# Altium schematic sheet audio_pa6.SchDoc: mcHF QRP Transceiver UI board
size A4; Author: K Atanassov; CompanyName: M0NKA; Revision: 0.6.3; SheetTotal: 5
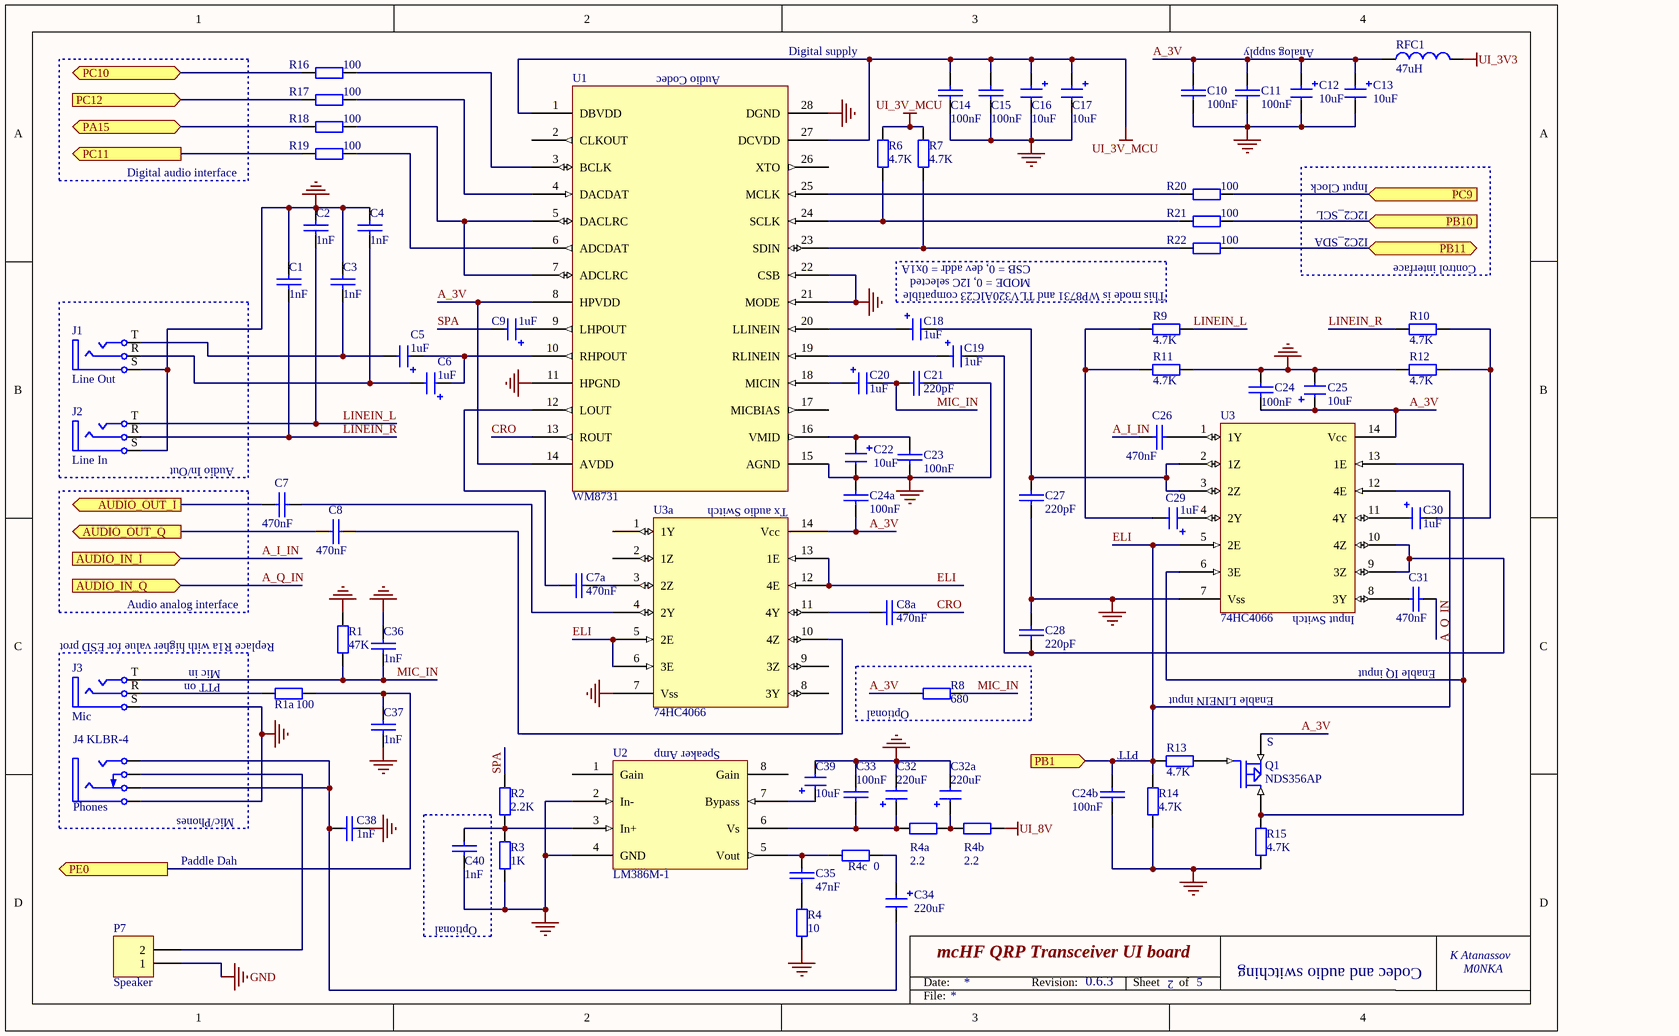
[diagram p0: audio_pa6.SchDoc]

## Parts
C1  1nF  [0805-Pro]
C2  1nF  [0805-Pro]
C3  1nF  [0805-Pro]
C4  1nF  [0805-Pro]
C5  1uF  [1206_ELEC_CAP_N]
C6  1uF  [1206_ELEC_CAP_N]
C7  470nF  [0805-Pro]
C7a  470nF  [0805-Pro]
C8  470nF  [0805-Pro]
C8a  470nF  [0805-Pro]
C9  1uF  [1206_ELEC_CAP_N]
C10  100nF  [0805-Pro]
C11  100nF  [0805-Pro]
C12  10uF  [1206_ELEC_CAP_N]
C13  10uF  [1206_ELEC_CAP_N]
C14  100nF  [0805-Pro]
C15  100nF  [0805-Pro]
C16  10uF  [1206_ELEC_CAP_N]
C17  10uF  [1206_ELEC_CAP_N]
C18  1uF  [1206_ELEC_CAP_N]
C19  1uF  [1206_ELEC_CAP_N]
C20  1uF  [1206_ELEC_CAP_N]
C21  220pF  [0805-Pro]
C22  10uF  [1206_ELEC_CAP_N]
C23  100nF  [0805-Pro]
C24  100nF  [0805-Pro]
C24a  100nF  [0805-Pro]
C24b  100nF  [0805-Pro]
C25  10uF  [1206_ELEC_CAP_N]
C26  470nF  [0805-Pro]
C27  220pF  [0805-Pro]
C28  220pF  [0805-Pro]
C29  1uF  [1206_ELEC_CAP_N]
C30  1uF  [1206_ELEC_CAP_N]
C31  470nF  [0805-Pro]
C32  220uF  [CAP_ALUM]
C32a  220uF  [CAP_ALUM]
C33  100nF  [0805-Pro]
C34  220uF  [CAP_ALUM]
C35  47nF  [0805-Pro]
C36  1nF  [0805-Pro]
C37  1nF  [0805-Pro]
C38  1nF  [0805-Pro]
C39  10uF  [1206_ELEC_CAP_N]
C40  1nF  [0805-Pro]
J1  Line Out  [MX-387GL_new1]
J2  Line In  [MX-387GL_new1]
J3  Mic  [MX-387GL_new1]
J4  KLBR-4  Function: Phones  [KLBR4]
P7  Speaker  [SIP2]
Q1  NDS356AP  [SOT-23-Pro]
R1  47K  [0805-Pro]
R1a  100  [0805-Pro]
R2  2.2K  [0805-Pro]
R3  1K  [0805-Pro]
R4  10  [0805-Pro]
R4a  2.2  [1206]
R4b  2.2  [1206]
R4c  0  [0805-Pro]
R6  4.7K  [0805-Pro]
R7  4.7K  [0805-Pro]
R8  680  [0805-Pro]  (no BOM)
R9  4.7K  [0805-Pro]
R10  4.7K  [0805-Pro]
R11  4.7K  [0805-Pro]
R12  4.7K  [0805-Pro]
R13  4.7K  [0805-Pro]
R14  4.7K  [0805-Pro]
R15  4.7K  [0805-Pro]
R16  100  [0805-Pro]
R17  100  [0805-Pro]
R18  100  [0805-Pro]
R19  100  [0805-Pro]
R20  100  [0805-Pro]
R21  100  [0805-Pro]
R22  100  [0805-Pro]
RFC1  47uH  [0805-Pro]
U1  WM8731  [SSOP-28-Pro]
U2  LM386M-1  [SO-8-Pro]
U3  74HC4066  [SO-14-Pro]
U3a  74HC4066  [SO-14-Pro]

## Blocks framed on the sheet
Audio In/Out: J1 J2
Optional: R8
Optional: C40

## Ports
AUDIO_IN_I (in), AUDIO_IN_Q (in), AUDIO_OUT_I (out), AUDIO_OUT_Q (out), PA15 (bidir), PB1 (in), PB10 (in), PB11 (bidir), PC9 (in), PC10 (bidir), PC11 (out), PC12 (in), PE0 (out)

## Nets
GND: C1.1 C2.1 C3.1 C4.1 C10.1 C11.1 C12.2 C13.2 C14.1 C15.1 C16.2 C17.2 C21.1 C22.2 C23.1 C24.2 C24a.1 C24b.1 C25.2 C27.2 C28.1 C32.2 C32a.2 C33.2 C36.1 C37.2 C38.2 C39.2 C40.1 J1.S J2.S J3.S J4.S P7.1 R1.2 R3.1 R4.1 R11.1 R12.2 R14.2 R15.2 U1.11(HPGND) U1.15(AGND) U1.21(MODE) U1.22(CSB) U1.28(DGND) U2.2(In-) U2.4(GND) U3.7(Vss) U3a.7(Vss)
UI_3V3: RFC1.2
UI_3V_MCU: C14.2 C15.2 C16.1 C17.1 R6.1 R7.1 U1.1(DBVDD) U1.27(DCVDD)
UI_8V: R4b.1
A_3V: C10.2 C11.2 C12.1 C13.1 C24.1 C24a.2 C25.1 Q1.2(S) R8.1 RFC1.1 U1.8(HPVDD) U1.14(AVDD) U3.14(Vcc) U3a.14(Vcc)
A_I_IN: C26.1 ; port AUDIO_IN_I
A_Q_IN: C31.2 ; port AUDIO_IN_Q
AUDIO_OUT_I: C7.1 ; port AUDIO_OUT_I
AUDIO_OUT_Q: C8.1 ; port AUDIO_OUT_Q
CRO: C8a.2 U1.13(ROUT)
ELI: C24b.2 R13.2 R14.1 U3.5(2E) U3.12(4E) U3a.5(2E) U3a.6(3E) U3a.12(4E) U3a.13(1E) ; port PB1
LINEIN_L: C2.2 J2.T R9.1
LINEIN_R: C1.2 J2.R R10.2
MIC_IN: C20.2 C21.2 C36.2 J3.T R1.1 R8.2
PA15: R18.1 ; port PA15
PB10: R21.2 ; port PB10
PB11: R22.2 ; port PB11
PC9: R20.2 ; port PC9
PC10: R16.1 ; port PC10
PC11: R19.1 ; port PC11
PC12: R17.1 ; port PC12
PE0: C37.1 R1a.2 ; port PE0
SPA: C9.2 R2.2
NetC3_2: C3.2 C5.2 J1.T
NetC4_2: C4.2 C6.2 J1.R
NetC5_1: C5.1 C6.1 U1.10(RHPOUT)
NetC7_2: C7.2 U3a.4(2Y)
NetC7a_1: C7a.1 U1.12(LOUT)
NetC7a_2: C7a.2 U3a.3(2Z)
NetC8_2: C8.2 U3a.10(4Z)
NetC8a_1: C8a.1 U3a.11(4Y)
NetC9_1: C9.1 U1.9(LHPOUT)
NetC18_1: C18.1 U1.20(LLINEIN)
NetC18_2: C18.2 C27.1 U3.2(1Z) U3.3(2Z)
NetC19_1: C19.1 U1.19(RLINEIN)
NetC19_2: C19.2 C28.2 U3.9(3Z) U3.10(4Z)
NetC20_1: C20.1 U1.18(MICIN)
NetC22_1: C22.1 C23.2 U1.16(VMID)
NetC26_2: C26.2 U3.1(1Y)
NetC29_1: C29.1 U3.4(2Y)
NetC29_2: C29.2 R9.2 R11.2
NetC30_1: C30.1 U3.11(4Y)
NetC30_2: C30.2 R10.1 R12.1
NetC31_1: C31.1 U3.8(3Y)
NetC32_1: C32.1 C33.1 R4a.2 U2.6(Vs)
NetC32a_1: C32a.1 R4a.1 R4b.2
NetC34_1: C34.1 R4c.2
NetC34_2: C34.2 C38.1 J4.R J4.T
NetC35_1: C35.1 R4.2
NetC35_2: C35.2 R4c.1 U2.5(Vout)
NetC39_1: C39.1 U2.7(Bypass)
NetC40_2: C40.2 R2.1 R3.2 U2.3(In+)
NetJ3_R: J3.R R1a.1
NetJ4_B: J4.B P7.2
NetQ1_1: Q1.1(G) R13.1
NetQ1_3: Q1.3(D) R15.1 U3.6(3E) U3.13(1E)
NetR6_2: R6.2 R21.1 U1.24(SCLK)
NetR7_2: R7.2 R22.1 U1.23(SDIN)
NetR16_2: R16.2 U1.3(BCLK)
NetR17_2: R17.2 U1.4(DACDAT)
NetR18_2: R18.2 U1.5(DACLRC) U1.7(ADCLRC)
NetR19_2: R19.2 U1.6(ADCDAT)
NetR20_1: R20.1 U1.25(MCLK)

Not connected (* = marked no-connect by the designer): U1 2(CLKOUT) 17(MICBIAS) 26(XTO); U2 1(Gain) 8(Gain); U3a 1(1Y) 2(1Z) 8(3Y) 9(3Z)

## Notes on the sheet
- Analog supply
- (near U1) Audio Codec
- Digital supply
- Digital audio interface
- Input Clock
- I2C2_SDA
- I2C2_SCL
- (near C18) MODE = 0, I2C selected
- CSB = 0, dev addr = 0x1A
- This mode is WP8731 and TLV320AIC23 compatible
- Control interface
- (near U3a) Tx audio Switch
- Audio analog interface
- Replace R1a with higher value for ESD prot
- (near U3) Input Switch
- PTT on
- Mic in
- Enable LINEIN input
- Enable IQ input
- (near U2) Speaker Amp
- PTT
- (near Q1) S
- (near J4) Mic/Phones
- Paddle Dah
- 2
- Codec and audio switching
- Date:
- Revision:
- Sheet
- of
- File:

## Library data of the parts
C1-C4 C36-C38 C40 = CAP: Capacitor; Order: FN 185-6408; QT Order: QCC-00259; Price: 0.01
C5 C6 C9 C18-C20 C29 C30 = CAP-POL: Electrolitic capacitor; Order: FN 145-7406; QT Order: QCC-00165; Price: 0.235
C7 C7a C8 C8a C26 C31 = CAP: Capacitor; Order: FN 232-0847; QT Order: QCC-00105; Price: 0.062
C10 C11 C14 C15 C23 C24 C24a C24b C33 = CAP: Capacitor; Order: FN 174-0673; QT Order: QCC-00154; Price: 0.068
C12 C13 C16 C17 C22 C25 C39 = CAP-POL: Electrolitic capacitor; Order: FN 233-3009; QT Order: QCC-00166; Price: 0.204
C21 C27 C28 = CAP: Capacitor; Order: FN 175-9208; QT Order: QCC-00072; Price: 0.069
C32 C32a C34 = CAP-POL: Electrolitic capacitor; Order: FN 225-4321; QT Order: QCC-00320; Price: 0.34
C35 = CAP: Capacitor; Order: FN 152-0303; QT Order: QCC-00101; Price: 0.03
J1-J3 = MX-387GL: Jack Socket,Thru-Hole; Order: FN 126-7376; Price: 0.59
J4 = PhoneJack: Jack Socket 4 pin; Order: FN 121-7016; Price: 1.28
P7 = Header 2: Header, 2-Pin; Order: FN 168-3898; Checked: NA; Price: 5.57
Q1 = NDS356AP: MOSFET transistor; Order: FN 984-6409; QT Order: QCT-00010; Price: 0.31
R1 = RES: Resistor; Order: FN 146-9929; QT Order: QCR-00365; Price: 0.021
R1a R16-R22 = RES: Resistor; Order: FN 933-2375; QT Order: QCR-00301; Price: 0.027
R2 = RES: Resistor; Order: FN 188-7289; QT Order: QCR-00333; Price: 0.046
R3 = RES: Resistor; Order: FN 157-6459; QT Order: QCR-00326; Price: 0.061
R4 = RES: Resistor; Order: FN 933-2421; QT Order: QCR-00279; Price: 0.013
R4a R4b = RES: Resistor; Order: FN 207-8984; QT Order: QCR-00412; Price: 0.02
R4c = RES: Resistor; Order: FN 933-3681; QT Order: QCR-00268; Price: 0.009
R6 R7 R9-R15 = RES: Resistor; Order: FN 200-8383; QT Order: QCR-00341; Price: 0.024
R8 = RES: Resistor; Order: FN 933-3460; QT Order: QCR-00321; Price: 0.054
RFC1 = Inductor: Order: FN 166-9895; Price: 0.16
U1 = WM8731: Audio CODEC; Order: FN 177-6264; Price: 3.01
U2 = LM386: Low Voltage Audio Power Amplifier; Order: FN 948-8324; Price: 0.63
U3 U3a = 74HC4066: Quad bilateral switch; Order: FN 120-1330; QT Order: QCI-00331; Price: 0.173